# Altium project VIPER12A.PrjPcb
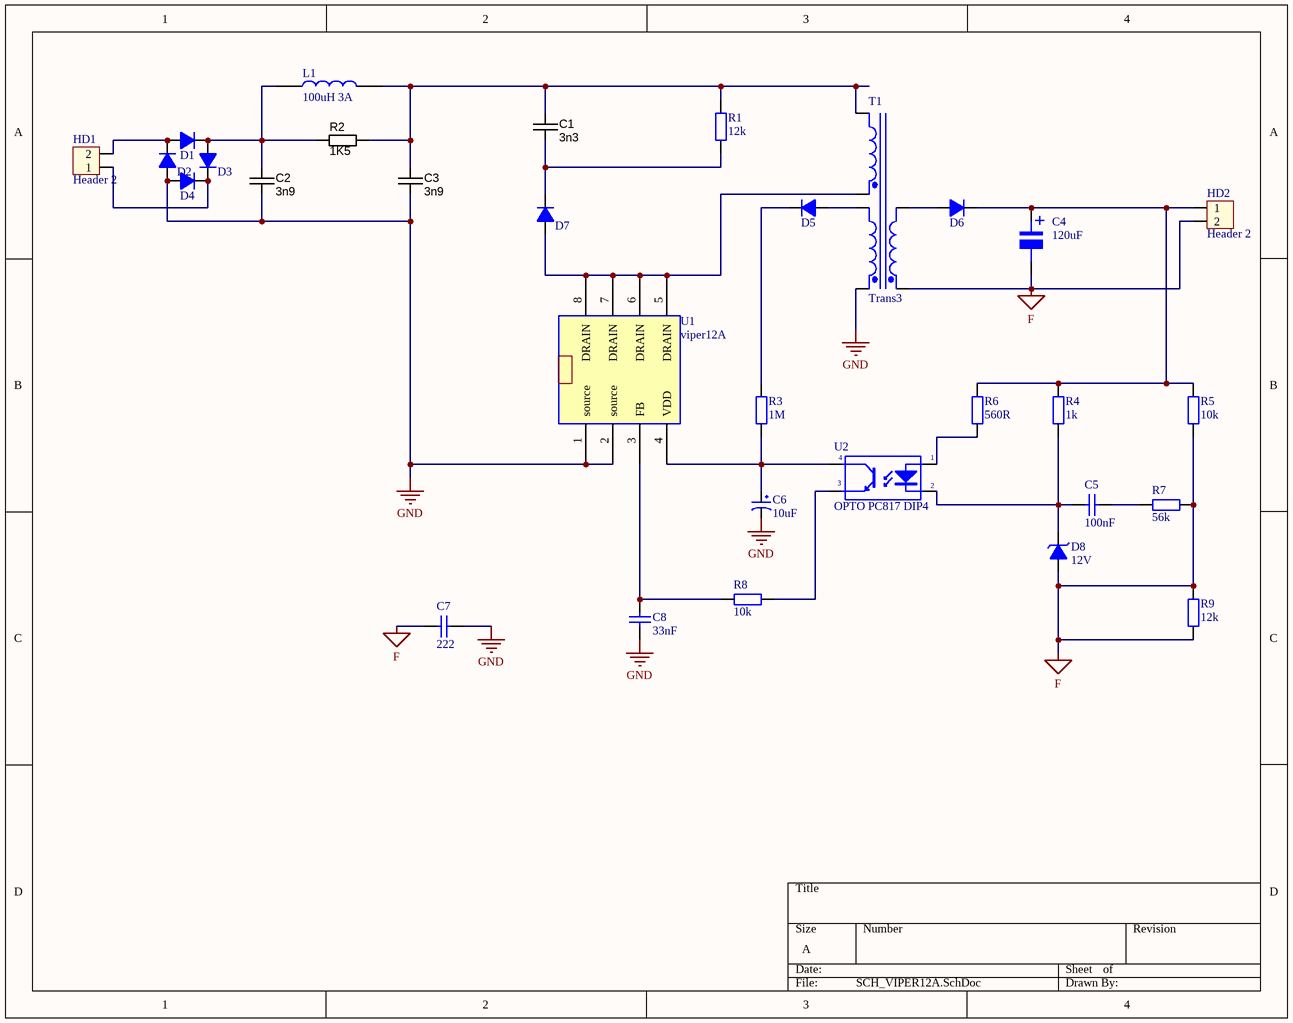
[diagram p0: SCH_VIPER12A.SchDoc]
1 sheet, 31 parts. Net scope: global (net labels, ports and power ports of the same name join across sheets).
Board file: PCB_VIPER12A.PcbDoc

## Sheet SCH_VIPER12A.SchDoc
size A; SheetNumber: 1; SheetTotal: 1

### Parts
C1  3n3  [CAPMF5.0-7.5mm_SL]
C2  3n9  [CAPMF5.0-7.5mm_SL]
C3  3n9  [CAPMF5.0-7.5mm_SL]
C4  120uF  [tu nhom 6.3 (d)]
C5  100nF  [tu tantalum dip5.08]
C6  10uF  [tu hoa 4mm]
C7  222  [tu gom]
C8  33nF  [tu 0402]
D1  Diode  1N4007  [DO-214AC]  (value not drawn)
D2  Diode  1N4007  [DO-214AC]  (value not drawn)
D3  Diode  1N4007  [DO-214AC]  (value not drawn)
D4  Diode  1N4007  [DO-214AC]  (value not drawn)
D5  Diode  1N4007  [DO-214AC]  (value not drawn)
D6  Diode  1N4007  [DO-214AC]  (value not drawn)
D7  Diode  1N4007  [DO-214AC]  (value not drawn)
D8  12V  [DIODE ZENNER SMD SOD80]
HD1  Header 2  [HED2]
HD2  Header 2  [HED2]
L1  100uH 3A  [CUON CAM 100uH3A]
R1  12k  [tro vach 1/4w]
R2  value 1K5  [RESTH_AXIAL-0.4]  (hidden comment: Carbon Film)
R3  1M  [tro smd 0603]
R4  1k  [tro smd 1206]
R5  10k  [tro smd 1206]
R6  560R  [tro smd 0805]
R7  56k  [tro vach 1/4w]
R8  10k  [tro smd 2512]
R9  12k  [tro vach 1/4w]
T1  Trans3  [TRF_6]
U1  viper12A  [DIP.100/8/W.300/L.400]
U2  OPTO PC817 DIP4  [DIP4]

### Nets
F: C4.2 C7.2 D8.1(A) HD2.2 R5.1 R7.2 R9.1 R9.2 T1.1(Pri+)
GND: C2.2 C3.2 C6.2 C7.1 C8.2 D2.A D4.A T1.3(Sec1+) U1.1(source) U1.2(source)
NetC1_1: C1.1 C3.1 L1.2 R1.2 R2.2 T1.6(Sec2-)
NetC1_2: C1.2 D7.K R1.1
NetC2_1: C2.1 D1.K D3.A L1.1 R2.1
NetC4_1: C4.1 D6.K HD2.1 R4.2 R5.2 R6.1
NetC5_1: C5.1 D8.2(K) R4.1 U2.2(K)
NetC5_2: C5.2 R7.1
NetC6_1: C6.1 R3.1 U1.4(VDD) U2.4(C)
NetC8_1: C8.1 R8.1 U1.3(FB)
NetD1_A: D1.A D2.K HD1.2
NetD3_K: D3.K D4.K HD1.1
NetD5_A: D5.A T1.4(Sec1-)
NetD5_K: D5.K R3.2
NetD6_A: D6.A T1.2(Pri-)
NetD7_A: D7.A T1.5(Sec2+) U1.5(DRAIN) U1.6(DRAIN) U1.7(DRAIN) U1.8(DRAIN)
NetR6_2: R6.2 U2.1(A)
NetR8_2: R8.2 U2.3(E)

### Notes on the sheet
- (in symbol Tu Nhom 120uF 10V) +

### Library data of the parts
C1 = CAPMF_3n3_400V_MPET: Capacitor THD Metallized PET Film 3.3nF 10% 400V; Manufacturer 1: Wing Fu Technology; Manufacturer Part Number 1: CL21-332-K-400V-7.5; Material: Metallized Polyester; SCDType: spec; Package / Case: 10.5L x 6.0W x 9.0H x 7.5mm Pitch; Tolerance: ±10%; Ratings: 400V; Value: 3n3
C2 C3 = CAPMF_3n9_400V_MPET: Capacitor THD Metallized PET Film 3.9nF 10% 400V; Manufacturer 1: Wing Fu Technology; Manufacturer Part Number 1: CL21-392-K-400V-7.5; Material: Metallized Polyester; SCDType: spec; Package / Case: 10.5L x 6.0W x 9.0H x 7.5mm Pitch; Tolerance: ±10%; Ratings: 400V; Value: 3n9
C4 = Tu Nhom 120uF 10V: Dán; So_Chan: 2; Don_Vi: Con; Ten_Linh_Kien: Tụ Nhôm 120uF 10V; Ma_Hang: MH004020; Chung_Loai: Dán; Kieu_Chan: *
C5 = Tu tantalum 100nF 50V 20% DIP5.08: Cắm; Don_Vi: Con; So_Chan: 2; Ten_Linh_Kien: Tụ tantalum 104-100nF 50V 20% DIP5.08 (sứ vàng)(10PCS); Ma_Hang: MH003955; Chung_Loai: Cắm; Kieu_Chan: *
C6 = Tu Hoa 10uF 25V 4x7: Cắm; So_Chan: 2; Ten_Linh_Kien: Tụ Hóa 10uF 25V 4x7MM; Don_Vi: Con; Ma_Hang: MH001349; Chung_Loai: Cắm; Kieu_Chan: *
C7 = Tu gom 222 50V: Cắm; Don_Vi: Con; So_Chan: 2; Ten_Linh_Kien: Tụ gốm 222-2.2nF 50V; Ma_Hang: MH004770; Chung_Loai: Cắm; Kieu_Chan: *
C8 = Tu 0402 33nF 10V: Dán; Don_Vi: Con; So_Chan: 2; Ten_Linh_Kien: Tụ 0402 33nF X7R 10V GRM155R71A333KA01D; Ma_Hang: MH007853; Chung_Loai: Dán; Kieu_Chan: *
D1-D7 = Diode  1N4007: Diode 1A; Value: 1N4007
D8 = Diode Zener 12V: Dán; Ma_Hang: MH000945; Don_Vi: Con; Ten_Linh_Kien: Diode Zener 1/2W 12V SMD1206 ZMM12; Kieu_Chan: *; Ghi_Chu: *; Chung_Loai: Dán
HD1 HD2 = Header 2: Header 2 (Green); Value: Header 2
L1 = CUON CAM 100uH DIP: Dán; Don_Vi: Con; Ma_Hang: MH002209; Ten_Linh_Kien: Cuộn Cảm 100uH 3A 8x10MM; Chung_Loai: Dán; Ghi Chu: *; Kieu Chan: *
R1 R9 = Tro Vach 1/4W 5% 12k: Cắm; Don_Vi: Con; So_Chan: 2; Ma_Hang: MH007389; Ten_Linh_Kien: Trở Vạch 1/4w 5% 12k; Chung_Loai: Cắm; Kieu_Chan: *
R2 = RES_Axial_0.5W: Resistor THD Axial 1.5k Ohm 0.5W 5% Carbon Film; Manufacturer 1: Yageo; Manufacturer Part Number 1: CFR-50JB-1K5; Ratings: 1/2W; SCDType: spec; Tolerance: ±5%; Package / Case: Axial; Supplier 1: Digi-Key; Supplier Part Number 1: 1.5KH-ND
R3 = Tro 0603 5% 1M: Dán; Don_Vi: Con; So_Chan: 2; Ten_Linh_Kien: Trở 0603 5% 1M; Ma_Hang: MH006909; Chung_Loai: Dán; Kieu_Chan: *
R4 = Tro 1206 1% 1k: Dán; Don_Vi: Con; So_Chan: 2; Ten_Linh_Kien: Trở 1206 1% 1k; Ma_Hang: MH005880; Chung_Loai: Dán; Kieu_Chan: *
R5 = Tro 1206 1% 10k: Dán; Don_Vi: Con; So_Chan: 2; Ten_Linh_Kien: Trở 1206 1% 10k; Ma_Hang: MH005885; Chung_Loai: Dán; Kieu_Chan: *
R6 = Tro 0805 5% 560R: Dán; Don_Vi: Con; So_Chan: 2; Ten_Linh_Kien: Trở 0805 5% 560R; Ma_Hang: MH005261; Chung_Loai: Dán; Kieu_Chan: *
R7 = Tro Vach 1/4W 5% 56k: Cắm; Don_Vi: Con; So_Chan: 2; Ten_Linh_Kien: Trở Vạch 1/4w 5% 56k; Ma_Hang: MH007329; Chung_Loai: Cắm; Kieu_Chan: *
R8 = Tro 2512 5% 10k: Dán; Don_Vi: Con; Ten_Linh_Kien: Trở 2512 5% 103-10k 1W; So_Chan: 2; Ma_Hang: MH003439; Chung_Loai: Dán; Kieu_Chan: *
T1 = Trans3: Three-winding Transformer (Non-Ideal); Sim Note: Enter the turns ratios, Core loss resistance, Magnetising Reactance, Leakage Reactances and Resistances referred to the primary side into the parameter fields.; Published: 25-Jan-2001; LatestRevisionDate: 17-Jul-2002; LatestRevisionNote: Re-released for DXP Platform.; PackageReference: TRF_6; Publisher: Altium Limited; PackageDescription: Transformer; 6 Leads
U2 = OPTO PC817 DIP4: Single Opto; Value: PC817